# EAGLE design controller (EAGLE 9.6.2)
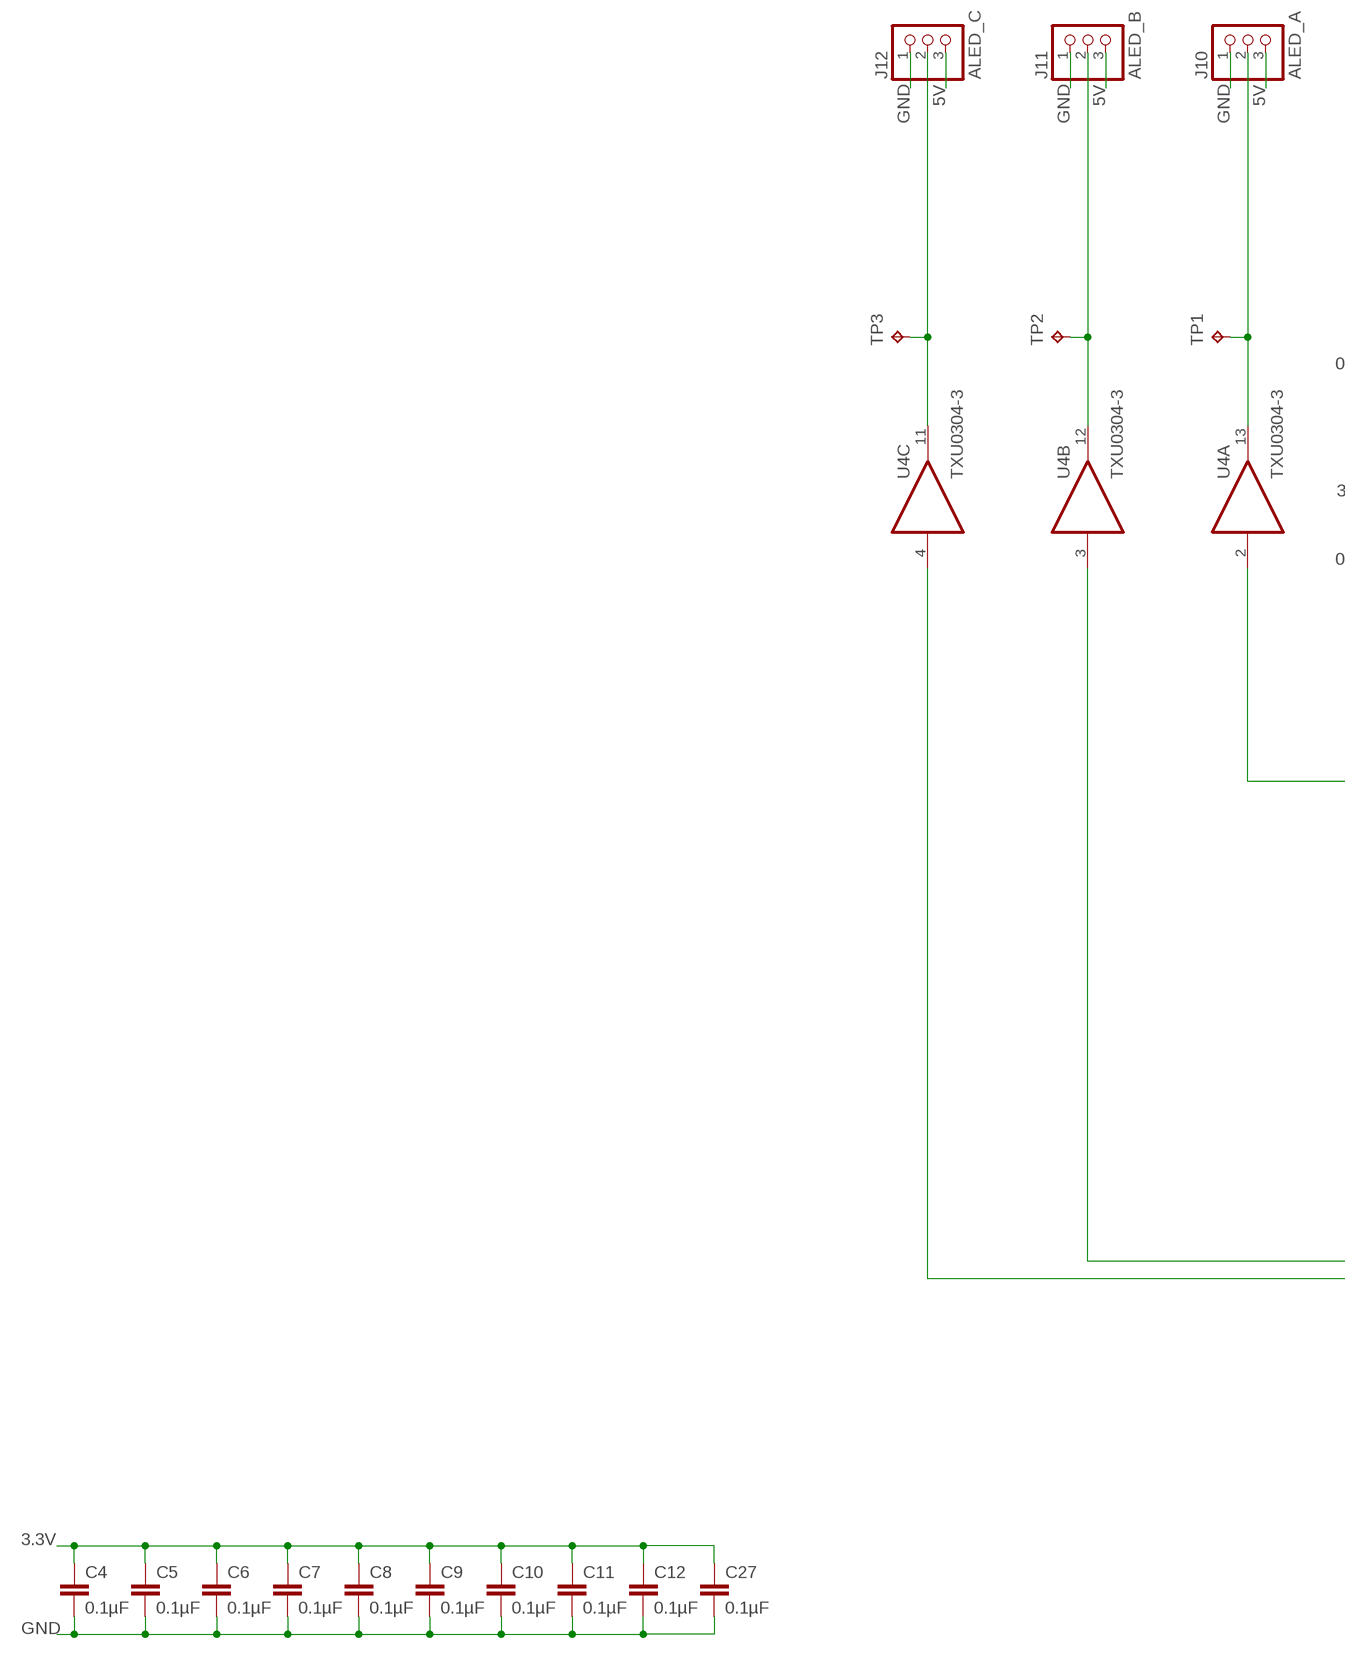
[diagram p0: schematic, sheet 1, part 1 of 3]
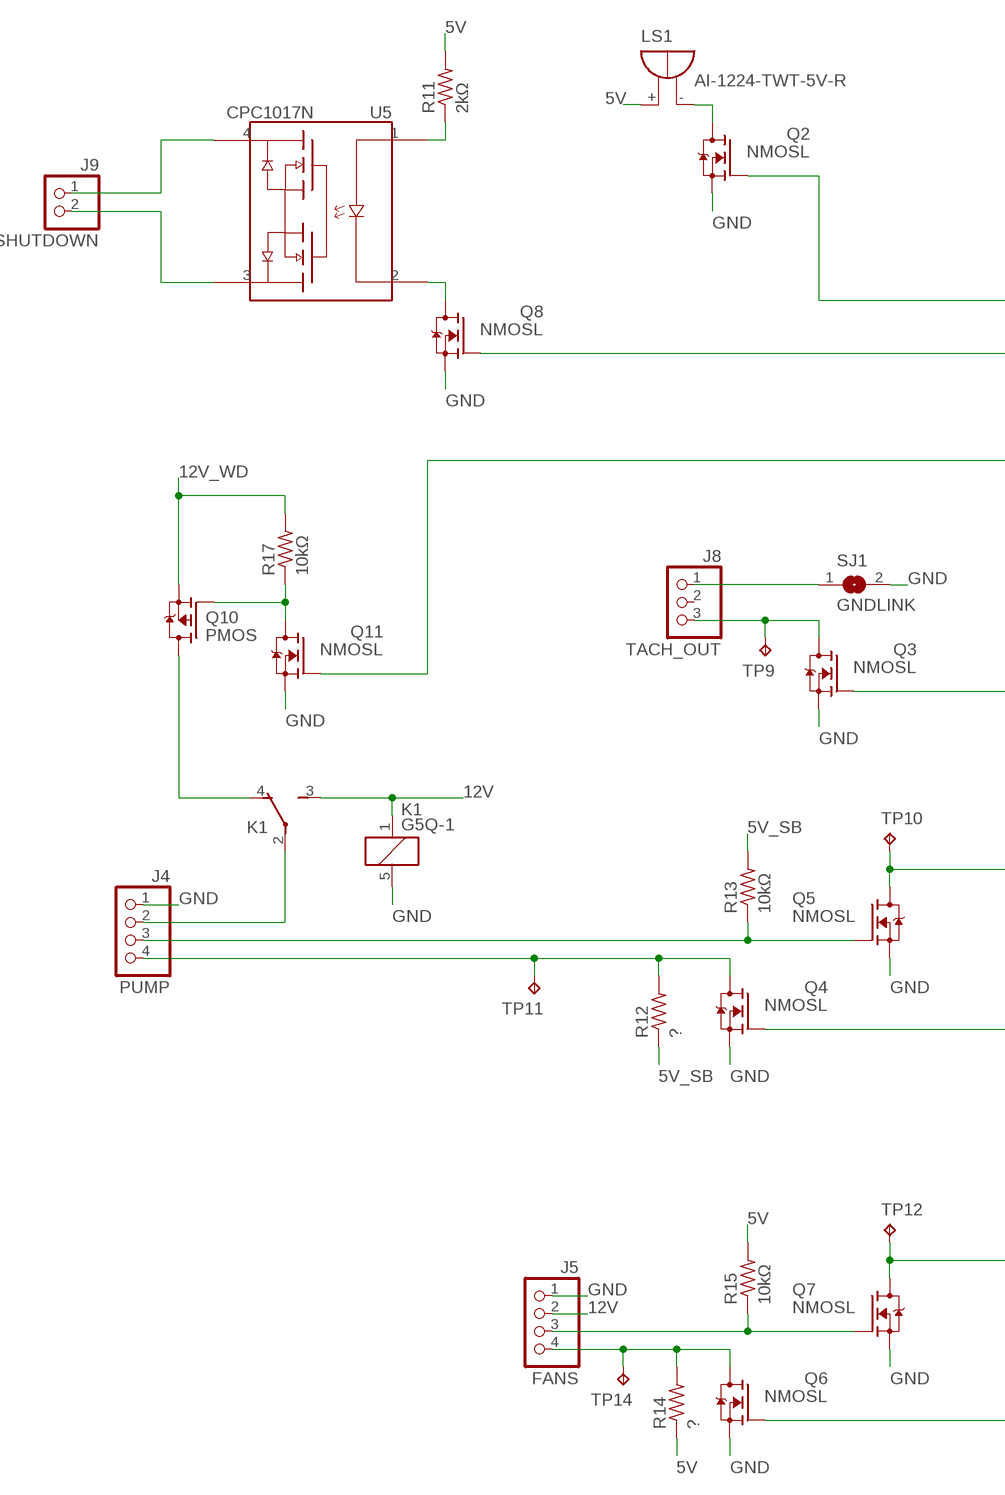
[diagram p1: schematic, sheet 1, part 2 of 3]
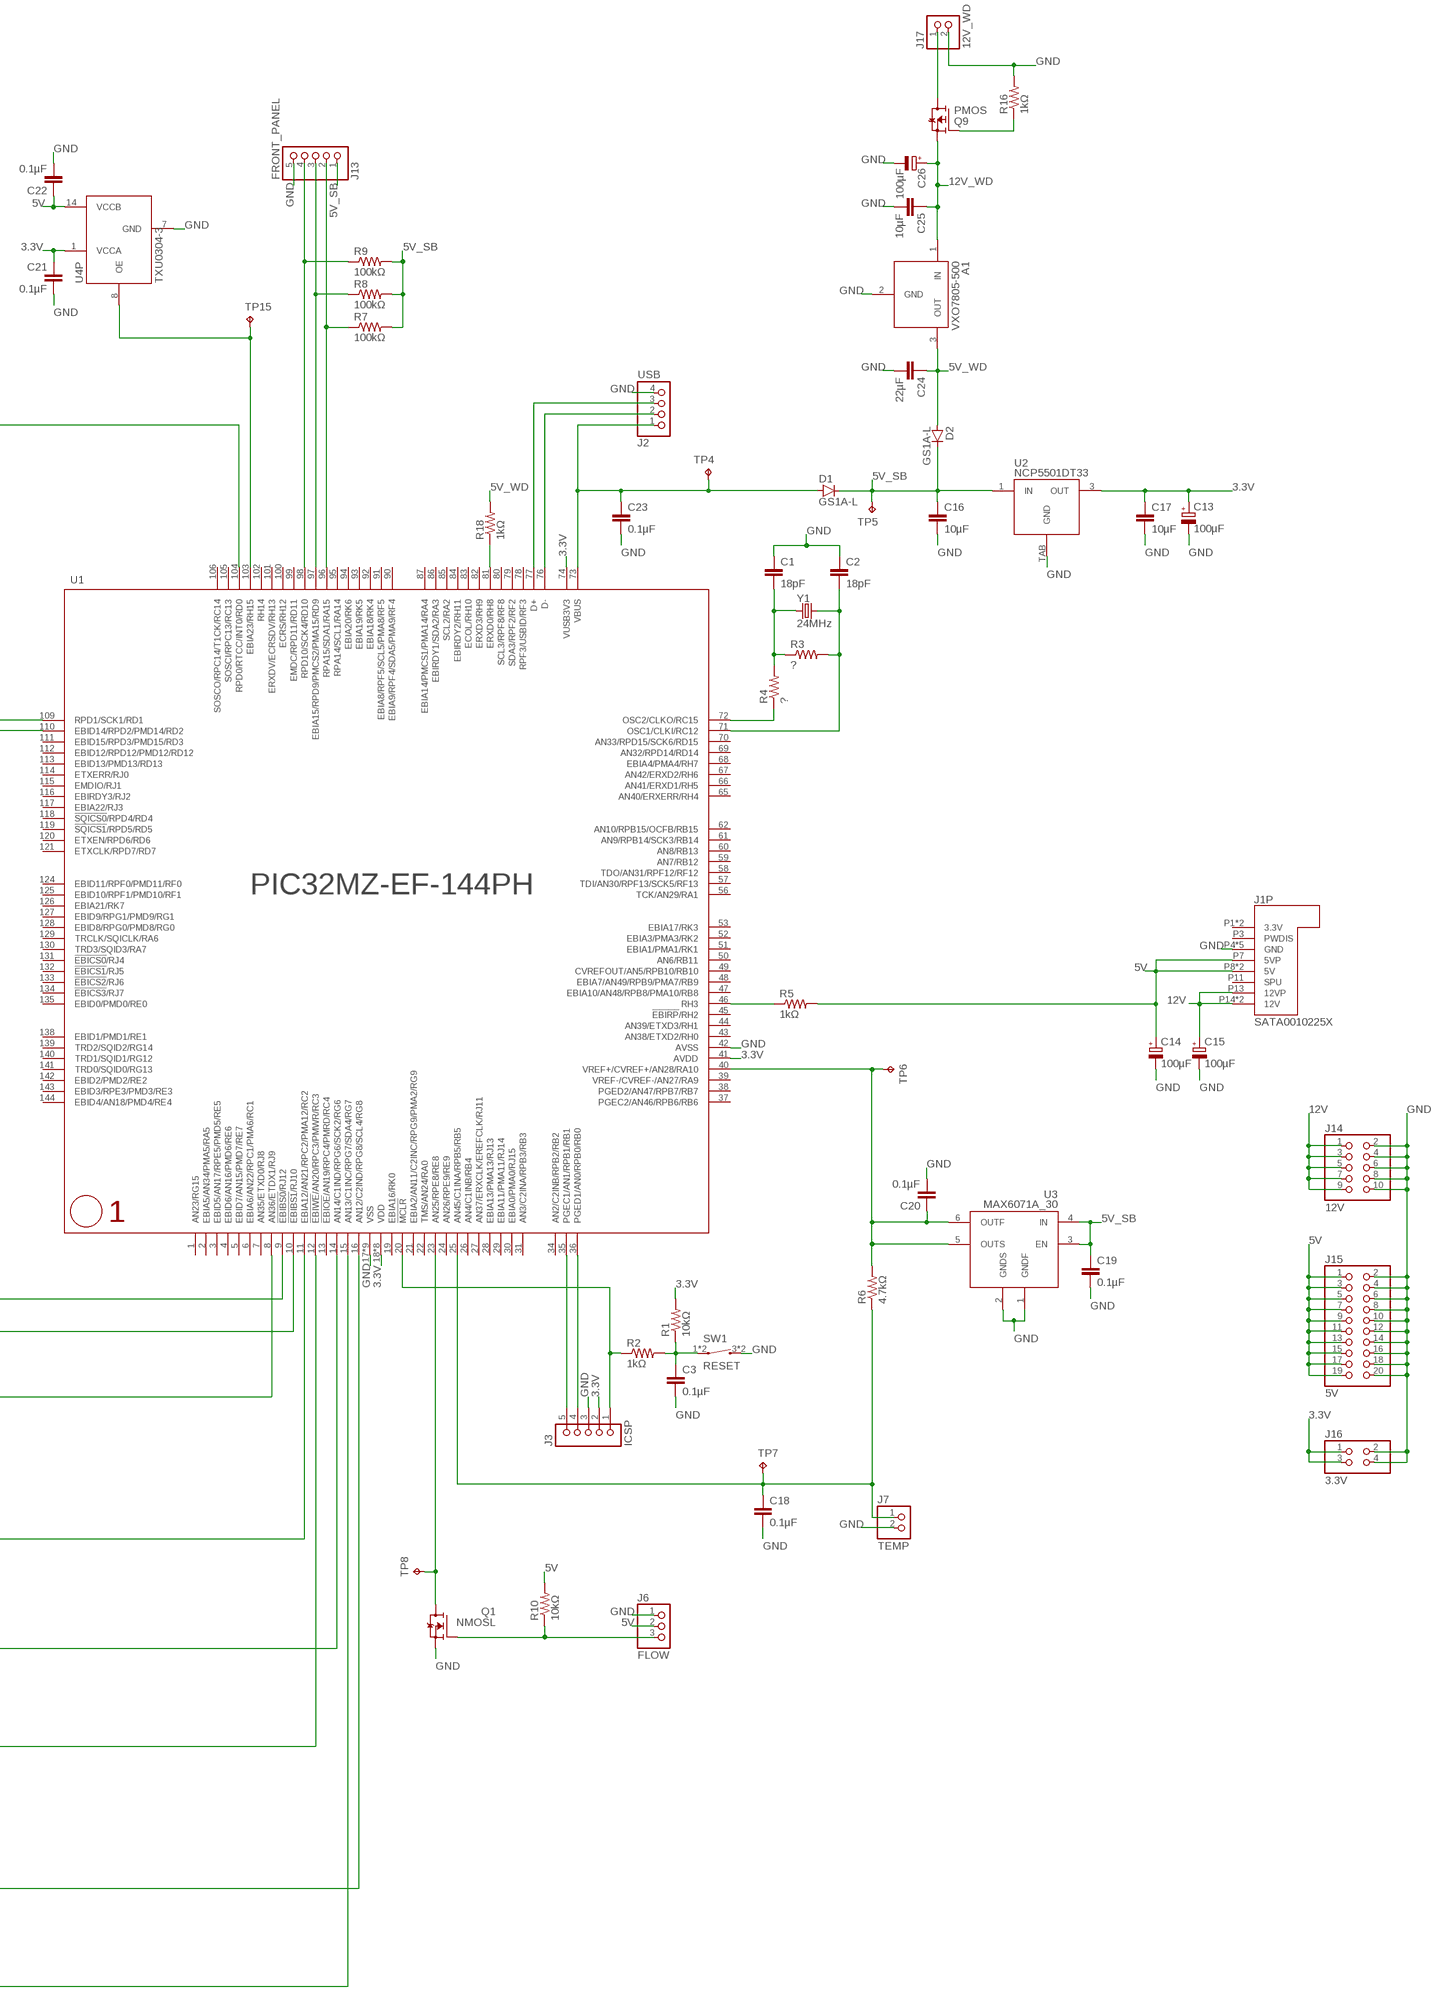
[diagram p2: schematic, sheet 1, part 3 of 3]

## Parts
A1  VXO7805-500  VXO78-500  [VXO78-500]
C1  18pF  C-EUC0603  [C0603]
C2  18pF  C-EUC0603  [C0603]
C3  0.1µF  C-EUC0603  [C0603]
C4  0.1µF  C-EUC0603  [C0603]
C5  0.1µF  C-EUC0603  [C0603]
C6  0.1µF  C-EUC0603  [C0603]
C7  0.1µF  C-EUC0603  [C0603]
C8  0.1µF  C-EUC0603  [C0603]
C9  0.1µF  C-EUC0603  [C0603]
C10  0.1µF  C-EUC0603  [C0603]
C11  0.1µF  C-EUC0603  [C0603]
C12  0.1µF  C-EUC0603  [C0603]
C13  100µF  CPOL-EUD  [PANASONIC_D]
C14  100µF  CPOL-EUD  [PANASONIC_D]
C15  100µF  CPOL-EUD  [PANASONIC_D]
C16  10µF  C-EUC0805  [C0805]
C17  10µF  C-EUC0805  [C0805]
C18  0.1µF  C-EUC0603  [C0603]
C19  0.1µF  C-EUC0603  [C0603]
C20  0.1µF  C-EUC0603  [C0603]
C21  0.1µF  C-EUC0603  [C0603]
C22  0.1µF  C-EUC0603  [C0603]
C23  0.1µF  C-EUC0603  [C0603]
C24  22µF  C-EUC0603  [C0603]
C25  10µF  C-EUC0805  [C0805]
C26  100µF  CPOL-EUD  [PANASONIC_D]
C27  0.1µF  C-EUC0603  [C0603]
D1  GS1A-L  DO-214AC-DIODE  [DO-214AC]
D2  GS1A-L  DO-214AC-DIODE  [DO-214AC]
J1  SATA0010225X  [SATA0010225X]
J2  USB  PINHD-1X4  [1X04]
J3  ICSP  5PIN-1.27  [5PIN-1.27]
J4  PUMP  47053-1000  [47053-1000]
J5  FANS  47053-1000  [47053-1000]
J6  FLOW  22-23-2032  [22-23-2032]
J7  TEMP  PINHD-1X2  [1X02]
J8  TACH_OUT  22-23-2032  [22-23-2032]
J9  SHUTDOWN  PINHD-1X2  [1X02]
J10  ALED_A  B3B-XH-A  [B3B-XH-A]
J11  ALED_B  B3B-XH-A  [B3B-XH-A]
J12  ALED_C  B3B-XH-A  [B3B-XH-A]
J13  FRONT_PANEL  PINHD-1X5  [1X05]
J14  12V  PINHD-2X5  [2X05]
J15  5V  PINHD-2X10  [2X10]
J16  3.3V  PINHD-2X2  [2X02]
J17  12V_WD  PINHD-1X2  [1X02]
K1  G5Q-1  [G5Q-1]
LS1  AI-1224-TWT-5V-R  [AI-1224-TWT-5V-R]
Q1  NMOSL  SOT23-N-MOSFET  [SOT23]
Q2  NMOSL  SOT23-N-MOSFET  [SOT23]
Q3  NMOSL  SOT23-N-MOSFET  [SOT23]
Q4  NMOSL  SOT23-N-MOSFET  [SOT23]
Q5  NMOSL  SOT23-N-MOSFET  [SOT23]
Q6  NMOSL  SOT23-N-MOSFET  [SOT23]
Q7  NMOSL  SOT23-N-MOSFET  [SOT23]
Q8  NMOSL  SOT23-N-MOSFET  [SOT23]
Q9  PMOS  SOT23-P-MOSFET  [SOT23]
Q10  PMOS  SOT23-P-MOSFET  [SOT23]
Q11  NMOSL  SOT23-N-MOSFET  [SOT23]
R1  10kΩ  R-US_R0603  [R0603]
R2  1kΩ  R-US_R0603  [R0603]
R3  ?  R-US_R0603  [R0603]
R4  ?  R-US_R0603  [R0603]
R5  1kΩ  R-US_R0603  [R0603]
R6  4.7kΩ  R-US_R0603  [R0603]
R7  100kΩ  R-US_R0603  [R0603]
R8  100kΩ  R-US_R0603  [R0603]
R9  100kΩ  R-US_R0603  [R0603]
R10  10kΩ  R-US_R0603  [R0603]
R11  2kΩ  R-US_R0603  [R0603]
R12  ?  R-US_R0603  [R0603]
R13  10kΩ  R-US_R0603  [R0603]
R14  ?  R-US_R0603  [R0603]
R15  10kΩ  R-US_R0603  [R0603]
R16  1kΩ  R-US_R0603  [R0603]
R17  10kΩ  R-US_R0603  [R0603]
R18  1kΩ  R-US_R0603  [R0603]
SJ1  GNDLINK  SJ  [SJ]
SW1  RESET  TL3305  [TL3305_MICROSWITCH]
TP1  RCU-0(J)  [TP_0603_JOINED]
TP2  RCU-0(J)  [TP_0603_JOINED]
TP3  RCU-0(J)  [TP_0603_JOINED]
TP4  RCU-0(J)  [TP_0603_JOINED]
TP5  RCU-0(J)  [TP_0603_JOINED]
TP6  RCU-0(J)  [TP_0603_JOINED]
TP7  RCU-0(J)  [TP_0603_JOINED]
TP8  RCU-0(J)  [TP_0603_JOINED]
TP9  RCU-0(J)  [TP_0603_JOINED]
TP10  RCU-0(J)  [TP_0603_JOINED]
TP11  RCU-0(J)  [TP_0603_JOINED]
TP12  RCU-0(J)  [TP_0603_JOINED]
TP14  RCU-0(J)  [TP_0603_JOINED]
TP15  RCU-0(J)  [TP_0603_JOINED]
U1  PIC32MZ-EF-144PH  [TQFP144-16X16]
U2  NCP5501DT33  DPAK-LDO  [DPAK]
U3  MAX6071A_30  [SOT23-6L]
U4  TXU0304-3  [TSSOP14]
U5  CPC1017N  [CPC10*N]
Y1  24MHz  HC49/4HSMX-CRYSTAL  [HC49/4HSMX]

## Nets
3.3V: C4.1 C5.1 C6.1 C7.1 C8.1 C9.1 C10.1 C11.1 C12.1 C13.+ C17.1 C21.1 C27.1 J3.2 J16.1 J16.3 R1.2 U1.18(VDD) U1.33(VDD) U1.41(AVDD) U1.55(VDD) U1.64(VDD) U1.74(VUSB3V3) U1.88(VDD) U1.107(VDD) U1.122(VDD) U1.137(VDD) U2.3(OUT) U4.1(P:VCCA)
3V_REF: C20.1 R6.2 TP6.1(TP) U1.40(VREF+/CVREF+/AN28/RA10) U3.5(OUTS) U3.6(OUTF)
5V: C14.+ C22.1 J1.P7(P:5VP) J1.P8(P:5V) J1.P9(P:5V) J6.2 J10.3 J11.3 J12.3 J15.1 J15.3 J15.5 J15.7 J15.9 J15.11 J15.13 J15.15 J15.17 J15.19 LS1.+ R5.2 R10.2 R11.2 R14.1 R15.2 U4.14(P:VCCB)
5V_SB: C16.1 C19.1 D1.C D2.C J13.1 R7.2 R8.2 R9.2 R12.1 R13.2 TP5.1(TP) U2.1(IN) U3.3(EN) U3.4(IN)
5V_USB: C23.1 D1.A J2.1 TP4.1(TP) U1.73(VBUS)
5V_WD: A1.3(OUT) C24.1 D2.A R18.2
12V: C15.+ J1.P13(P:12VP) J1.P14(P:12V) J1.P15(P:12V) J5.2 J14.1 J14.3 J14.5 J14.7 J14.9 K1.1 K1.3(S)
12V_PUMP: J4.2 K1.2(P)
12V_PUMP_WD: K1.4(O) Q10.3(D)
12V_WD: A1.1(IN) C25.1 C26.+ Q9.2(S) Q10.2(S) R17.2
12V_WD_PROTECT: Q9.1(G) R16.1
12V_WD_RAW: J17.1 Q9.3(D)
!MCLR: J3.1 R2.1 U1.20(!MCLR)
!MCLR!_FILTER: C3.1 R1.1 R2.2 SW1.1 SW1.2
ALED_A: J10.2 TP1.1(TP) U4.13(A:O)
ALED_A_RAW: U1.104(RPD0/RTCC/INT0/RD0) U4.2(A:I)
ALED_B: J11.2 TP2.1(TP) U4.12(B:O)
ALED_B_RAW: U1.109(RPD1/SCK1/RD1) U4.3(B:I)
ALED_C: J12.2 TP3.1(TP) U4.11(C:O)
ALED_C_RAW: U1.110(EBID14/RPD2/PMD14/RD2) U4.4(C:I)
ALED_OE: TP15.1(TP) U1.103(EBIA23/RH15) U4.8(P:OE)
BUZZER_EN: Q2.1(G) U1.9(!EBIBS0!/RJ12)
BUZZER_L: LS1.- Q2.3(D)
EMERGENCY_SD_C1: J9.1 U5.4
EMERGENCY_SD_C2: J9.2 U5.3
EMERGENCY_SD_DRIVE+: R11.1 U5.1(A)
EMERGENCY_SD_DRIVE-: Q8.3(D) U5.2(K)
EMERGENCY_SD_TRIGGER: Q8.1(G) U1.10(!EBIBS1!/RJ10)
FAN_PWM: J5.4 Q6.3(D) R14.2 TP14.1(TP)
FAN_PWM_DRIVE: Q6.1(G) U1.15(AN13/C1INC/RPG7/SDA4/RG7)
FAN_TACH: Q7.3(D) TP12.1(TP) U1.16(AN12/C2IND/RPG8/SCL4/RG8)
FAN_TACH_RAW: J5.3 Q7.1(G) R15.1
FLOW_TACH: Q1.3(D) TP8.1(TP) U1.23(AN25/RPE8/RE8)
FLOW_TACH_RAW: J6.3 Q1.1(G) R10.1
FPLED_!B: J13.4 R9.1 U1.98(RPD10/SCK4/RD10)
FPLED_!G: J13.3 R8.1 U1.97(EBIA15/RPD9/PMCS2/PMA15/RD9)
FPLED_!R: J13.2 R7.1 U1.96(RPA15/SDA1/RA15)
GND: A1.2(GND) C1.1 C2.1 C3.2 C4.2 C5.2 C6.2 C7.2 C8.2 C9.2 C10.2 C11.2 C12.2 C13.- C14.- C15.- C16.2 C17.2 C18.2 C19.2 C20.2 C21.2 C22.2 C23.2 C24.2 C25.2 C26.- C27.2 J1.P4(P:GND) J1.P5(P:GND) J1.P6(P:GND) J1.P10(P:GND) J1.P12(P:GND) J2.4 J3.3 J4.1 J5.1 J6.1 J7.2 J10.1 J11.1 J12.1 J13.5 J14.2 J14.4 J14.6 J14.8 J14.10 J15.2 J15.4 J15.6 J15.8 J15.10 J15.12 J15.14 J15.16 J15.18 J15.20 J16.2 J16.4 J17.2 K1.5 Q1.2(S) Q2.2(S) Q3.2(S) Q4.2(S) Q5.2(S) Q6.2(S) Q7.2(S) Q8.2(S) Q11.2(S) R16.2 SJ1.2 SW1.3 SW1.4 U1.17(VSS) U1.32(VSS) U1.42(AVSS) U1.54(VSS) U1.63(VSS) U1.75(VSS) U1.89(VSS) U1.108(VSS) U1.123(VSS) U1.136(VSS) U2.TAB(GND) U3.1(GNDF) U3.2(GNDS) U4.7(P:GND)
OSC1: C2.2 R3.2 U1.71(OSC1/CLKI/RC12) Y1.2
OSC2: R4.1 U1.72(OSC2/CLKO/RC15)
OSC2_R: C1.2 R3.1 R4.2 Y1.1
PGEC: J3.5 U1.35(PGEC1/AN1/RPB1/RB1)
PGED: J3.4 U1.36(PGED1/AN0/RPB0/RB0)
POWER_SENSE: R5.1 U1.46(RH3)
PUMP_PWM: J4.4 Q4.3(D) R12.2 TP11.1(TP)
PUMP_PWM_DRIVE: Q4.1(G) U1.12(!EBIWE!/AN20/RPC3/PMWR/RC3)
PUMP_TACH: Q5.3(D) TP10.1(TP) U1.14(AN14/C1IND/RPG6/SCK2/RG6)
PUMP_TACH_RAW: J4.3 Q5.1(G) R13.1
PUMP_WD_DRIVE: Q10.1(G) Q11.3(D) R17.1
PUMP_WD_RUN: Q11.1(G) U1.8(AN36/ETDX1/RJ9)
TACH_OUT: J8.3 Q3.3(D) TP9.1(TP)
TACH_OUT_DRIVE: Q3.1(G) U1.11(EBIA12/AN21/RPC2/PMA12/RC2)
TACH_OUT_GNDLINK: J8.1 SJ1.1
TEMP_SENSE: C18.1 J7.1 R6.1 TP7.1(TP) U1.25(AN45/C1INA/RPB5/RB5)
USB_D+: J2.3 U1.77(D+)
USB_D-: J2.2 U1.76(D-)
WD_DETECT: R18.1 U1.81(ERXD0/RH8)
Unconnected: J1.D1(D:GND) J1.D2(D:A+) J1.D3(D:A-) J1.D4(D:GND) J1.D5(D:B-) J1.D6(D:B+) J1.D7(D:GND) J1.P1(P:3.3V) J1.P2(P:3.3V) J1.P3(P:PWDIS) J1.P11(P:SPU) J8.2 U1.1(AN23/RG15) U1.2(EBIA5/AN34/PMA5/RA5) U1.3(EBID5/AN17/RPE5/PMD5/RE5) U1.4(EBID6/AN16/PMD6/RE6) U1.5(EBID7/AN15/PMD7/RE7) U1.6(EBIA6/AN22/RPC1/PMA6/RC1) U1.7(AN35/ETXD0/RJ8) U1.13(!EBIOE!/AN19/RPC4/PMRD/RC4) U1.19(EBIA16/RK0) U1.21(EBIA2/AN11/C2INC/RPG9/PMA2/RG9) U1.22(TMS/AN24/RA0) U1.24(AN26/RPE9/RE9) U1.26(AN4/C1INB/RB4) U1.27(AN37/ERXCLK/EREFCLK/RJ11) U1.28(EBIA13/PMA13/RJ13) U1.29(EBIA11/PMA11/RJ14) U1.30(EBIA0/PMA0/RJ15) U1.31(AN3/C2INA/RPB3/RB3) U1.34(AN2/C2INB/RPB2/RB2) U1.37(PGEC2/AN46/RPB6/RB6) U1.38(PGED2/AN47/RPB7/RB7) U1.39(VREF-/CVREF-/AN27/RA9) U1.43(AN38/ETXD2/RH0) U1.44(AN39/ETXD3/RH1) U1.45(!EBIRP!/RH2) U1.47(EBIA10/AN48/RPB8/PMA10/RB8) U1.48(EBIA7/AN49/RPB9/PMA7/RB9) U1.49(CVREFOUT/AN5/RPB10/RB10) U1.50(AN6/RB11) U1.51(EBIA1/PMA1/RK1) U1.52(EBIA3/PMA3/RK2) U1.53(EBIA17/RK3) U1.56(TCK/AN29/RA1) U1.57(TDI/AN30/RPF13/SCK5/RF13) U1.58(TDO/AN31/RPF12/RF12) U1.59(AN7/RB12) U1.60(AN8/RB13) U1.61(AN9/RPB14/SCK3/RB14) U1.62(AN10/RPB15/OCFB/RB15) U1.65(AN40/ERXERR/RH4) U1.66(AN41/ERXD1/RH5) U1.67(AN42/ERXD2/RH6) U1.68(EBIA4/PMA4/RH7) U1.69(AN32/RPD14/RD14) U1.70(AN33/RPD15/SCK6/RD15) U1.78(RPF3/USBID/RF3) U1.79(SDA3/RPF2/RF2) U1.80(SCL3/RPF8/RF8) U1.82(ERXD3/RH9) U1.83(ECOL/RH10) U1.84(EBIRDY2/RH11) U1.85(SCL2/RA2) U1.86(EBIRDY1/SDA2/RA3) U1.87(EBIA14/PMCS1/PMA14/RA4) U1.90(EBIA9/RPF4/SDA5/PMA9/RF4) U1.91(EBIA8/RPF5/SCL5/PMA8/RF5) U1.92(EBIA18/RK4) U1.93(EBIA19/RK5) U1.94(EBIA20/RK6) U1.95(RPA14/SCL1/RA14) U1.99(EMDC/RPD11/RD11) U1.100(ECRS/RH12) U1.101(ERXDV/ECRSDV/RH13) U1.102(RH14) U1.105(SOSCI/RPC13/RC13) U1.106(SOSCO/RPC14/T1CK/RC14) U1.111(EBID15/RPD3/PMD15/RD3) U1.112(EBID12/RPD12/PMD12/RD12) U1.113(EBID13/PMD13/RD13) U1.114(ETXERR/RJ0) U1.115(EMDIO/RJ1) U1.116(EBIRDY3/RJ2) U1.117(EBIA22/RJ3) U1.118(!SQICS0!/RPD4/RD4) U1.119(!SQICS1!/RPD5/RD5) U1.120(ETXEN/RPD6/RD6) U1.121(ETXCLK/RPD7/RD7) U1.124(EBID11/RPF0/PMD11/RF0) U1.125(EBID10/RPF1/PMD10/RF1) U1.126(EBIA21/RK7) U1.127(EBID9/RPG1/PMD9/RG1) U1.128(EBID8/RPG0/PMD8/RG0) U1.129(TRCLK/SQICLK/RA6) U1.130(TRD3/SQID3/RA7) U1.131(!EBICS0!/RJ4) U1.132(!EBICS1!/RJ5) U1.133(!EBICS2!/RJ6) U1.134(!EBICS3!/RJ7) U1.135(EBID0/PMD0/RE0) U1.138(EBID1/PMD1/RE1) U1.139(TRD2/SQID2/RG14) U1.140(TRD1/SQID1/RG12) U1.141(TRD0/SQID0/RG13) U1.142(EBID2/PMD2/RE2) U1.143(EBID3/RPE3/PMD3/RE3) U1.144(EBID4/AN18/PMD4/RE4) U4.5(D:O) U4.10(D:I)

## Library data of the parts
A1 = BW-Active:VXO78-500: Low power switching voltage regulator module, 500mA output
C1-C12 C16-C25 C27 = rcl:C-EU: CAPACITOR, European symbol; SPICEPREFIX: C
C13-C15 C26 = rcl:CPOL-EU: POLARIZED CAPACITOR, European symbol; SPICEPREFIX: C
D1 D2 = BW-Active:DO-214AC-DIODE
J1 = BW-Connectors:SATA0010225X: SATA 15+7 pin male connector
J2 = pinhead:PINHD-1X4: PIN HEADER
J3 = BW-Connectors:5PIN-1.27: 5 pin header with 1.27mm pitch
J4 J5 = BW-Connectors:47053-1000: 4-pin Molex KK connector (PC fan, 3+1)
J6 J8 = BW-Connectors:22-23-2032: 3-pin Molex KK connector (PC fan)
J7 J9 J17 = pinhead:PINHD-1X2: PIN HEADER
J10-J12 = BW-Connectors:*3B-XH-A: JST XH 3-pin locking header
J13 = pinhead:PINHD-1X5: PIN HEADER
J14 = pinhead:PINHD-2X5: PIN HEADER
J15 = pinhead:PINHD-2X10: PIN HEADER
J16 = pinhead:PINHD-2X2: PIN HEADER
K1 = BW-PassiveMechanical:G5Q-1: Form C (DPDT) PCB relay
LS1 = BW-Active:AI-1224-TWT-5V-R: 5V DC buzzer
Q1-Q8 Q11 = BW-Active:SOT23-N-MOSFET
Q9 Q10 = BW-Active:SOT23-P-MOSFET
R1-R18 = resistor:R-US_: RESISTOR, American symbol
SJ1 = jumper:SJ: SMD solder JUMPER
SW1 = BW-PassiveMechanical:TL3305: Tactile microswitch
TP1-TP12 TP14 TP15 = BW-PassiveMechanical:RCU-0: Solderable probe pad in 0603 form
U1 = BW-Active:PIC32MZ-EF-144: 32-bit 200MHz microcontroller, 144-pin
U2 = BW-Active:DPAK-LDO
U3 = BW-Active:MAX6071*: Precision voltage reference
U4 = BW-Active:TXU0*04: 4-pin unidirectional level shifter
U5 = BW-Active:CPC1017N: 100mA solid state relay
Y1 = BW-PassiveMechanical:HC49/4HSMX-CRYSTAL

## Board
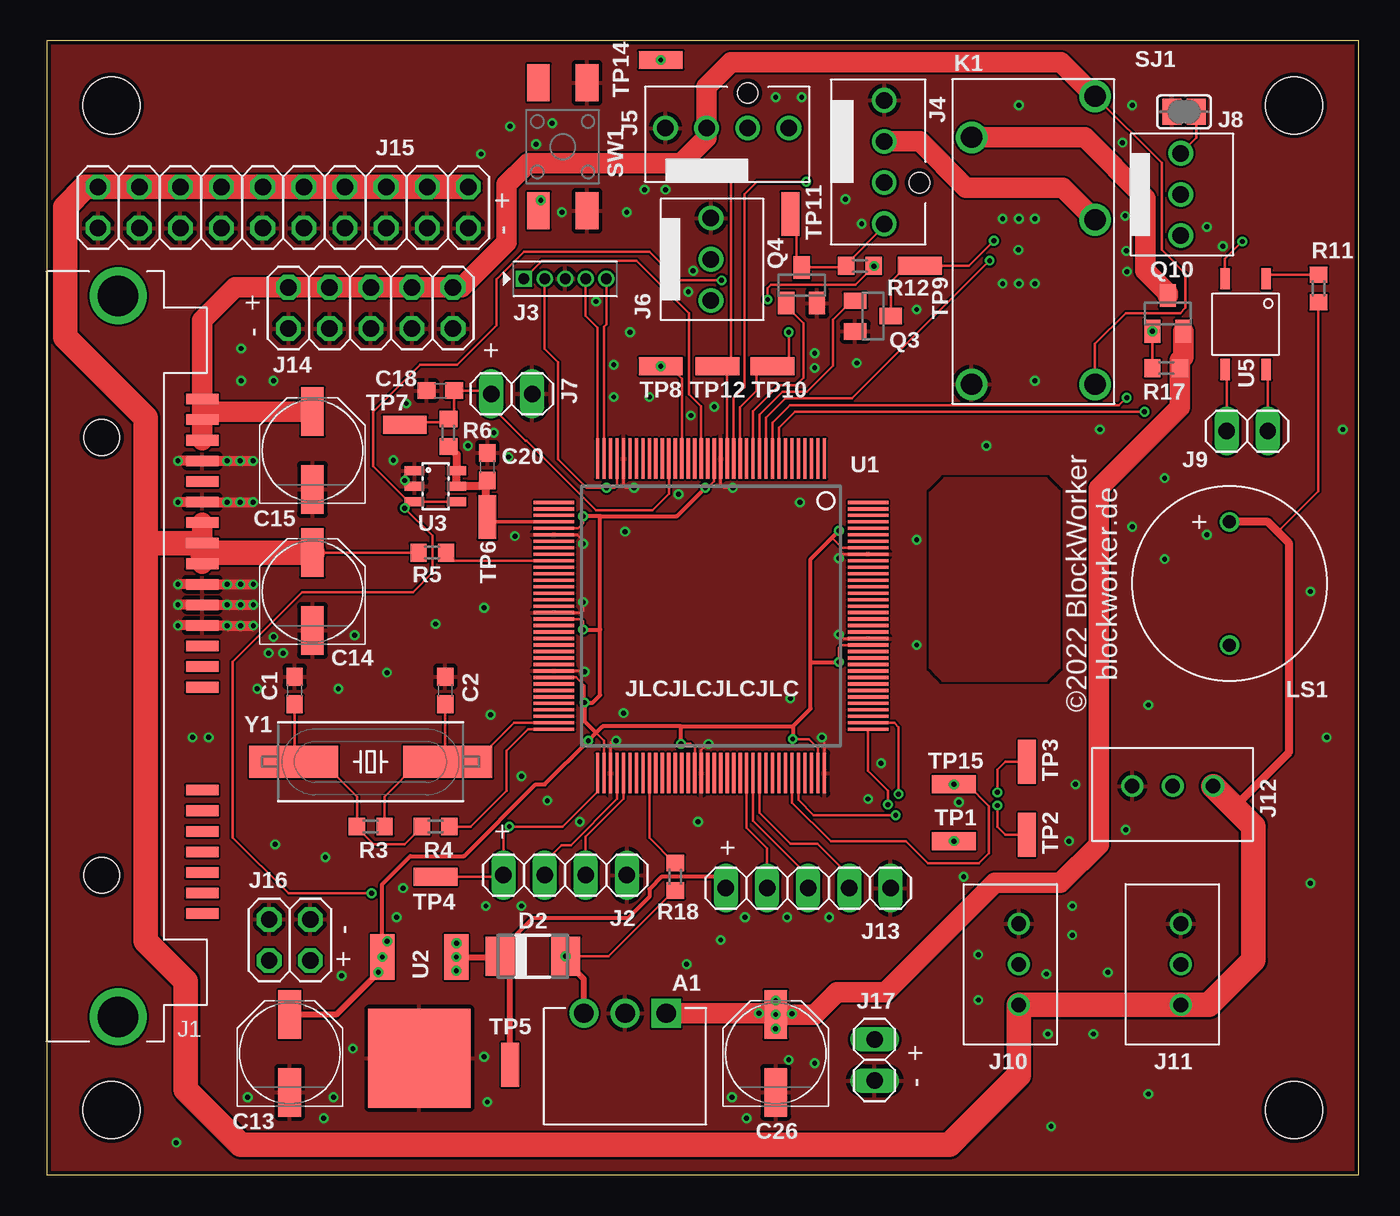
[diagram p3: board, top side]
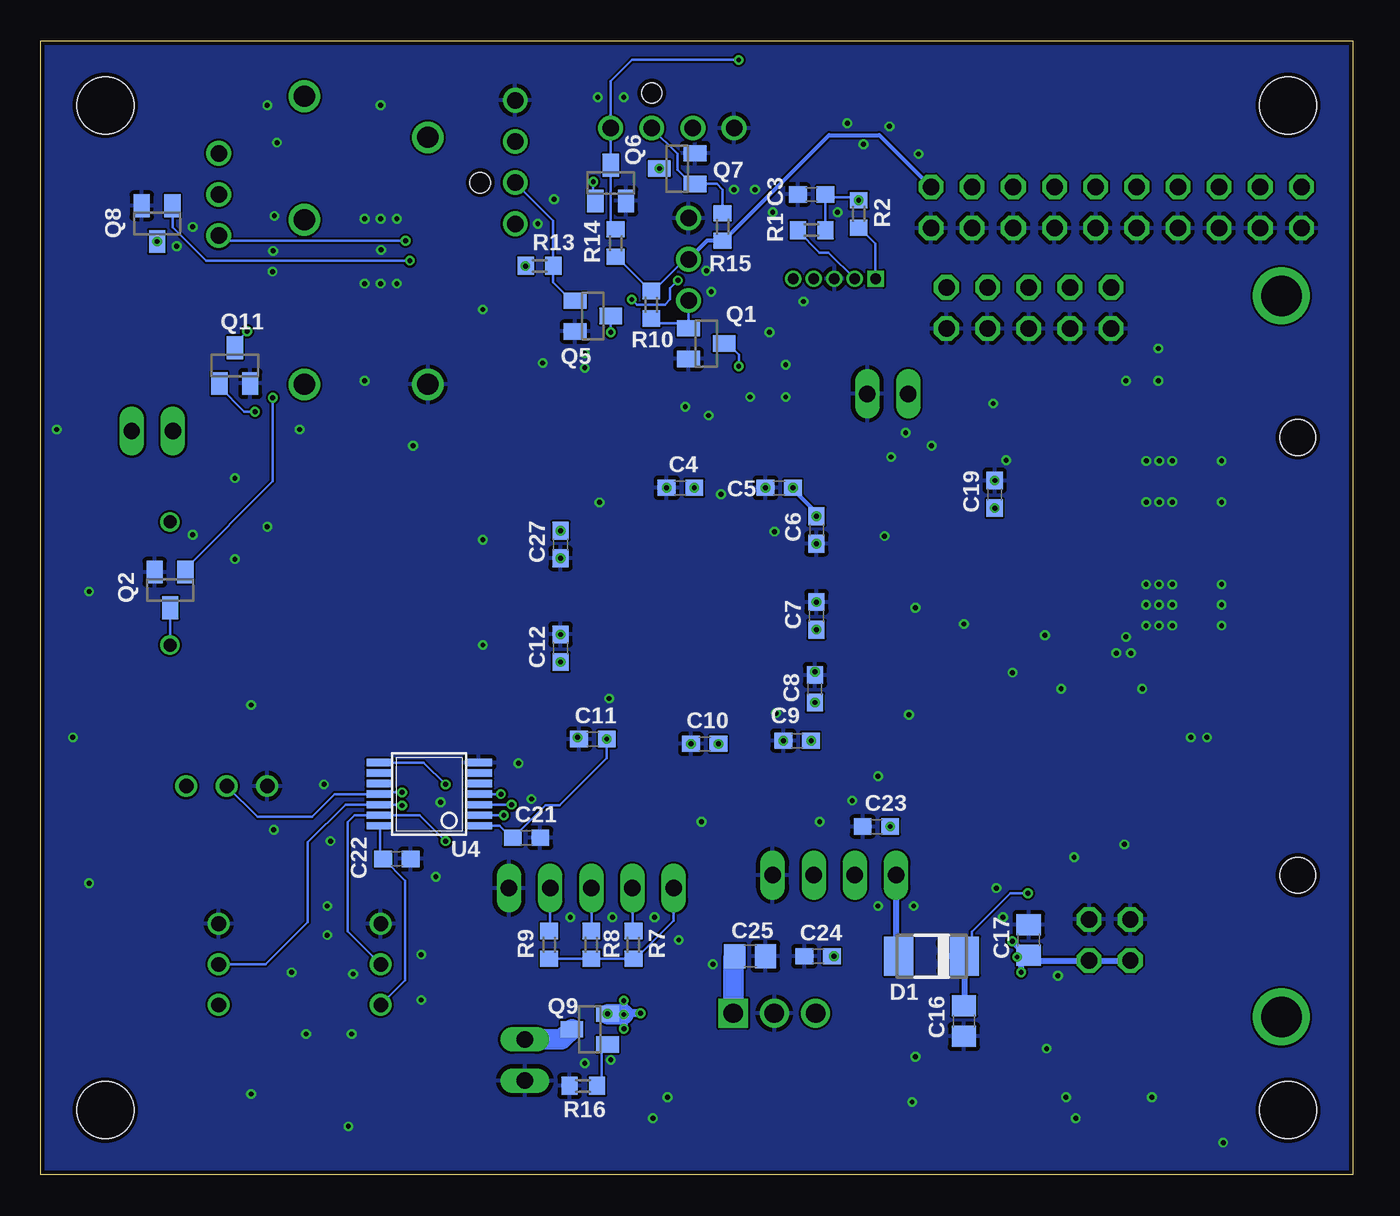
[diagram p4: board, bottom side, seen from below]

Size 81 x 70 mm. Coordinates in mm from the lower left corner, seen from the top.
Outline: 0,0 81,0 81,70 0,70 0,0
Copper layers (1*16): Top 0.035mm / dielectric 1.6mm / Bottom 0.035mm
Design rules "jlcpcb-2l": minimum track width 5mil, minimum drill 0.3mm, track to track 5mil, track to pad 5mil, pad to pad 5mil, via to via 5mil, smd to smd 0mil, copper to edge 0.25mm, drill to drill 0.5mm, minimum pad ring 0.15mm, minimum via ring 0.15mm, stop-mask expansion 4mil, vias tented up to drill 0.3mm, thermal gap 10mil
Holes 3.5 mm at 4,4 4,66 77,4 77,66
tKeepout: area 1,1 to 7,7; area 1,63 to 7,69; area 74,1 to 80,7; area 74,63 to 80,69

### Footprints (pad centres in the part's own frame; a part is rotated, then mirrored left to right if it is on the bottom)
VXO78-500 = drill 1.2 square: 1 -2.54,-3.28 | drill 1.2: 2 0,-3.28; 3 2.54,-3.28
C0603 = smd 1.1 x 1: 1 -0.85,0; 2 0.85,0
PANASONIC_D = smd 3 x 1.4: + 2.4,0; - -2.4,0
C0805 = smd 1.3 x 1.5: 1 -0.95,0; 2 0.95,0
DO-214AC = smd 1.8 x 2.4: A 2.025,0; C -2.025,0
SATA0010225X = smd 0.65 x 2: D1 15.875,9.6; D2 14.605,9.6; D3 13.335,9.6; D4 12.065,9.6; D5 10.795,9.6; D6 9.525,9.6; D7 8.255,9.6; P1 1.905,9.6; P2 0.635,9.6; P3 -0.635,9.6; P4 -1.905,9.6; P5 -3.175,9.6; P6 -4.445,9.6; P7 -5.715,9.6; P8 -6.985,9.6; P9 -8.255,9.6; P10 -9.525,9.6; P11 -10.795,9.6; P12 -12.065,9.6; P13 -13.335,9.6; P14 -14.605,9.6; P15 -15.875,9.6 | drill 2.5: H1 -22.25,4.4; H2 22.25,4.4 | hole 2.2: -13.5,3.4; 13.5,3.4
1X04 = drill 1.016 long: 1 -3.81,0; 2 -1.27,0; 3 1.27,0; 4 3.81,0
5PIN-1.27 = drill 0.65 pad 1.016 square: 1 -2.54,0 | drill 0.65 pad 1.016: 2 -1.27,0; 3 0,0; 4 1.27,0; 5 2.54,0
47053-1000 = drill 1.016: 1 3.81,0; 2 1.27,0; 3 -1.27,0; 4 -3.81,0 | hole 1.25: -1.27,-2.16
22-23-2032 = drill 1.016: 1 2.54,0; 2 0,0; 3 -2.54,0
1X02 = drill 1.016 long: 1 -1.27,0; 2 1.27,0
B3B-XH-A = drill 0.9: 1 -2.5,0; 2 0,0; 3 2.5,0
1X05 = drill 1.016 long: 1 -5.08,0; 2 -2.54,0; 3 0,0; 4 2.54,0; 5 5.08,0
2X05 = drill 1.016 octagon: 1 -5.08,-1.27; 2 -5.08,1.27; 3 -2.54,-1.27; 4 -2.54,1.27; 5 0,-1.27; 6 0,1.27; 7 2.54,-1.27; 8 2.54,1.27; 9 5.08,-1.27; 10 5.08,1.27
2X10 = drill 1.016 octagon: 1 -11.43,-1.27; 2 -11.43,1.27; 3 -8.89,-1.27; 4 -8.89,1.27; 5 -6.35,-1.27; 6 -6.35,1.27; 7 -3.81,-1.27; 8 -3.81,1.27; 9 -1.27,-1.27; 10 -1.27,1.27; 11 1.27,-1.27; 12 1.27,1.27; 13 3.81,-1.27; 14 3.81,1.27; 15 6.35,-1.27; 16 6.35,1.27; 17 8.89,-1.27; 18 8.89,1.27; 19 11.43,-1.27; 20 11.43,1.27
2X02 = drill 1.016 octagon: 1 -1.27,-1.27; 2 -1.27,1.27; 3 1.27,-1.27; 4 1.27,1.27
G5Q-1 = drill 1.3: 1 -8.82,-3.81; 2 1.34,-3.81; 3 8.96,-3.81; 4 6.42,3.81; 5 -8.82,3.81
AI-1224-TWT-5V-R = drill 0.8: + -3.8,0; - 3.8,0
SOT23 = smd 1 x 1.4: 1 -0.95,-1.1; 2 0.95,-1.1; 3 0,1.1
R0603 = smd 1 x 1.1: 1 -0.85,0; 2 0.85,0
SJ = smd 1.168 x 1.6: 1 -0.762,0; 2 0.762,0
TL3305_MICROSWITCH = smd 2.3 x 1.4: 1 -1.7,0.75; 2 6.2,0.75; 3 -1.7,3.75; 4 6.2,3.75
TP_0603_JOINED = smd 2.7 x 1.1: 1 0,0
TQFP144-16X16 = smd 0.2 x 2.5: 1 -7,-9.7; 2 -6.6,-9.7; 3 -6.2,-9.7; 4 -5.8,-9.7; 5 -5.4,-9.7; 6 -5,-9.7; 7 -4.6,-9.7; 8 -4.2,-9.7; 9 -3.8,-9.7; 10 -3.4,-9.7; 11 -3,-9.7; 12 -2.6,-9.7; 13 -2.2,-9.7; 14 -1.8,-9.7; 15 -1.4,-9.7; 16 -1,-9.7; 17 -0.6,-9.7; 18 -0.2,-9.7; 19 0.2,-9.7; 20 0.6,-9.7; 21 1,-9.7; 22 1.4,-9.7; 23 1.8,-9.7; 24 2.2,-9.7; 25 2.6,-9.7; 26 3,-9.7; 27 3.4,-9.7; 28 3.8,-9.7; 29 4.2,-9.7; 30 4.6,-9.7; 31 5,-9.7; 32 5.4,-9.7; 33 5.8,-9.7; 34 6.2,-9.7; 35 6.6,-9.7; 36 7,-9.7; 73 7,9.7; 74 6.6,9.7; 75 6.2,9.7; 76 5.8,9.7; 77 5.4,9.7; 78 5,9.7; 79 4.6,9.7; 80 4.2,9.7; 81 3.8,9.7; 82 3.4,9.7; 83 3,9.7; 84 2.6,9.7; 85 2.2,9.7; 86 1.8,9.7; 87 1.4,9.7; 88 1,9.7; 89 0.6,9.7; 90 0.2,9.7; 91 -0.2,9.7; 92 -0.6,9.7; 93 -1,9.7; 94 -1.4,9.7; 95 -1.8,9.7; 96 -2.2,9.7; 97 -2.6,9.7; 98 -3,9.7; 99 -3.4,9.7; 100 -3.8,9.7; 101 -4.2,9.7; 102 -4.6,9.7; 103 -5,9.7; 104 -5.4,9.7; 105 -5.8,9.7; 106 -6.2,9.7; 107 -6.6,9.7; 108 -7,9.7 | smd 2.5 x 0.2: 37 9.7,-7; 38 9.7,-6.6; 39 9.7,-6.2; 40 9.7,-5.8; 41 9.7,-5.4; 42 9.7,-5; 43 9.7,-4.6; 44 9.7,-4.2; 45 9.7,-3.8; 46 9.7,-3.4; 47 9.7,-3; 48 9.7,-2.6; 49 9.7,-2.2; 50 9.7,-1.8; 51 9.7,-1.4; 52 9.7,-1; 53 9.7,-0.6; 54 9.7,-0.2; 55 9.7,0.2; 56 9.7,0.6; 57 9.7,1; 58 9.7,1.4; 59 9.7,1.8; 60 9.7,2.2; 61 9.7,2.6; 62 9.7,3; 63 9.7,3.4; 64 9.7,3.8; 65 9.7,4.2; 66 9.7,4.6; 67 9.7,5; 68 9.7,5.4; 69 9.7,5.8; 70 9.7,6.2; 71 9.7,6.6; 72 9.7,7; 109 -9.7,7; 110 -9.7,6.6; 111 -9.7,6.2; 112 -9.7,5.8; 113 -9.7,5.4; 114 -9.7,5; 115 -9.7,4.6; 116 -9.7,4.2; 117 -9.7,3.8; 118 -9.7,3.4; 119 -9.7,3; 120 -9.7,2.6; 121 -9.7,2.2; 122 -9.7,1.8; 123 -9.7,1.4; 124 -9.7,1; 125 -9.7,0.6; 126 -9.7,0.2; 127 -9.7,-0.2; 128 -9.7,-0.6; 129 -9.7,-1; 130 -9.7,-1.4; 131 -9.7,-1.8; 132 -9.7,-2.2; 133 -9.7,-2.6; 134 -9.7,-3; 135 -9.7,-3.4; 136 -9.7,-3.8; 137 -9.7,-4.2; 138 -9.7,-4.6; 139 -9.7,-5; 140 -9.7,-5.4; 141 -9.7,-5.8; 142 -9.7,-6.2; 143 -9.7,-6.6; 144 -9.7,-7
DPAK = smd 1.5 x 2.8: 1 -2.286,-3.95; 3 2.286,-3.95 | smd 6.3 x 6.1: TAB 0,2.3
SOT23-6L = smd 0.55 x 1.2: 1 -0.95,-1.3; 2 0,-1.3; 3 0.95,-1.3; 4 0.95,1.3; 5 0,1.3; 6 -0.95,1.3
TSSOP14 = smd 0.45 x 1.65: 1 -1.95,-3.05; 2 -1.3,-3.05; 3 -0.65,-3.05; 4 0,-3.05; 5 0.65,-3.05; 6 1.3,-3.05; 7 1.95,-3.05; 8 1.95,3.05; 9 1.3,3.05; 10 0.65,3.05; 11 0,3.05; 12 -0.65,3.05; 13 -1.3,3.05; 14 -1.95,3.05
CPC10*N = smd 1.3 x 0.6: 1 -2.8,1.27; 2 -2.8,-1.27; 3 2.8,-1.27; 4 2.8,1.27
HC49/4HSMX = smd 5.5 x 2: 1 -4.75,0; 2 4.75,0

### Placement (x,y rotation side)
A1  35.7,6.7 180 top
C1  15.3,29.9 270 top
C2  24.6,29.9 270 top
C3  33.4,60.5 180 bottom
C4  41.5,42.4 180 bottom
C5  35.4,42.4 180 bottom
C6  33.1,39.8 270 bottom
C7  33.1,34.5 90 bottom
C8  33.2,30 90 bottom
C9  34.3,26.8 180 bottom
C10  40,26.6 180 bottom
C11  46.9,26.9 180 bottom
C12  48.9,32.5 90 bottom
C13  15,7.5 90 top
C14  16.4,36 90 top
C15  16.4,44.7 90 top
C16  24,9.5 270 bottom
C17  20,14.5 90 bottom
C18  24.3,48.4 180 top
C19  22.1,42 90 bottom
C20  27.2,43.7 90 top
C21  51,20.8 0 bottom
C22  59,19.5 0 bottom
C23  29.4,21.5 180 bottom
C24  33,13.5 180 bottom
C25  37.2,13.5 0 bottom
C26  45,7.5 90 top
C27  48.9,38.9 270 bottom
D1  26,13.5 180 bottom
D2  30,13.5 0 top
J1  0,32 270 top
J2  32,18.5 0 top
J3  32,55.3 0 top
J4  51.7,62.5 90 top
J5  42,64.6 180 top
J6  41,56.5 90 top
J7  28.7,48.2 0 top
J8  70,60.5 90 top
J9  74.1,45.9 180 top
J10  60,13 270 top
J11  70,13 270 top
J12  69.5,24 0 top
J13  47,17.7 0 top
J14  20,53.5 180 top
J15  14.6,59.7 180 top
J16  15,14.5 0 top
J17  51.1,7.1 270 top
K1  60.9,57.6 90 top
LS1  73,36.5 270 top
Q1  39.9,51.3 270 bottom
Q2  73,36.1 180 bottom
Q3  51,53 270 top
Q4  46.6,54.9 0 top
Q5  46.9,53 270 bottom
Q6  45.8,61.2 0 bottom
Q7  41.7,62.1 90 bottom
Q8  73.8,58.7 180 bottom
Q9  47.1,9 90 bottom
Q10  69.2,53.16 0 top
Q11  69,49.94 0 bottom
R1  33.4,58.3 180 bottom
R2  30.5,59.3 90 bottom
R3  20,21.5 0 top
R4  24,21.5 180 top
R5  23.8,38.4 180 top
R6  24.8,45.8 270 top
R7  44.4,14.2 270 bottom
R8  47,14.2 270 bottom
R9  49.6,14.2 270 bottom
R10  43.3,53.7 90 bottom
R11  78.5,54.7 270 top
R12  50.2,56.1 180 top
R13  50.2,56.1 180 bottom
R14  45.5,57.5 90 bottom
R15  38.9,58.5 270 bottom
R16  47.5,5.5 180 bottom
R17  69.1,49.78 0 top
R18  38.8,18.4 270 top
SJ1  70.2,65.6 180 top
SW1  29.6,65.7 270 top
TP1  56,20.6 0 top
TP2  60.5,21 90 top
TP3  60.5,25.5 90 top
TP4  24,18.4 0 top
TP5  28.6,6.8 270 top
TP6  27.2,40.6 90 top
TP7  22.1,46.3 180 top
TP8  37.9,49.9 0 top
TP9  53.9,56.1 0 top
TP10  44.8,49.9 0 top
TP11  45.9,59.3 90 top
TP12  41.4,49.9 0 top
TP14  37.9,68.8 0 top
TP15  56,24.1 0 top
U1  41,34.5 180 top
U2  23,9.5 180 top
U3  24,42.5 270 top
U4  57,23.5 90 bottom
U5  74,52.5 270 top
Y1  20,25.5 0 top

### Tracks (layer width: path | path; a pad name or v marks a point on that pad's centre or on a via)
3.3V  (via drill 0.3)
  Top 0.152: C4.1 40.8,42.4 41.2,42.8 U1.18 | U1.33 35.2,42.55 35.05,42.4 C5.1 33.31,42.4 31.56,44.16 31.56,50.16 30.73,50.99 J3.2 | C6.1 33.1,40.2 32.8,39.9 U1.41 | U1.55 32.98,34.3 33.1,34.18 C7.1 | C8.1 33.2,30.18 32.68,30.7 U1.64 | C10.1 39.75,26.6 40,26.35 U1.88 | C11.1 47.04,26.9 47.6,26.34 U1.107 | C12.1 48.9,32.53 49.07,32.7 U1.122 | U1.137 49.1,38.7 48.48,39.33 | U1.74 34.4,26.8 33.91,27.29
  Top 0.254: U2.3 20.71,17.95 22.44,19.68 25.76,19.68 30.18,24.1 30.73,24.1 v33.43,26.8 33.91,27.29 | 39.15,27.68 34.31,27.68 33.91,27.29 | C10.1 39.15,27.68 | 39.15,27.68 46.05,27.68 | 46.05,27.68 47.15,28.78 47.15,31.65 | 46.05,27.68 C11.1 | 47.15,31.65 C12.1 | 47.15,31.65 47.15,38 48.48,39.33 C27.1 | 34.16,40.65 C6.1 | 34.16,33.66 34.16,29.61 33.7,29.15 C8.1 33.2,28 33.91,27.29 | 34.16,33.66 34.16,40.65 | 34.16,40.65 38.9,40.65 C4.1 | C7.1 34.15,33.65 34.16,33.66
  Top 0.381: C13.+ 17.86,9.9 v20.47,12.51 20.47,13.21 U2.3 20.71,14.11 v21.02,14.42
  Bottom 0.152: U4.1 52.65,21.55 51.9,20.8 C21.1 51.83,20.8 49.83,22.8 48.96,22.8 46.05,25.71 C11.1 | R1.2 34.25,58.25 32.92,56.92 32.35,56.92 J3.2 | C9.1 v33.43,26.8
  Bottom 0.254: C5.1 34.47,42.32 34.47,42.22 33.2,40.95 33.2,40.61 33.18,40.63 33.12,40.63 C6.1
  Bottom 0.381: C17.1 19.68,13.23 J16.3 J16.1 | v21.02,14.42 20.15,13.55 C17.1 | U2.3 20.1,13.45 C17.1 | C17.1 20.47,13.08 v20.47,12.51
  other vias: 20.71,13.45 40.65,42.4 34.55,42.4 33.1,40.65 33.1,33.65 33.2,29.15 39.15,26.6 46.05,26.9 48.9,31.65 48.9,39.75
3V_REF
  Top 0.203: U1.40 27.5,40.3
  Top 0.305: TP6.1 27.5,40.3
  Top 0.508: R6.2 25.3,44.45 U3.6 U3.5 26.85,42.5 C20.1 27.08,42.73 27.08,40.72 TP6.1
5V
  Top 0.152: R11.2 78.5,42.18 76,39.68 | R5.2 C14.+
  Top 0.508: LS1.+ 75.38,40.3 76,39.68 76.66,39.02 76.66,26.06 73.3,22.7
  Top 1.27: J1.P9 J1.P8 | J1.P7 J1.P8 | 9.6,38.4 J1.P8
  Top 1.524: C14.+ 9.6,38.4 | J1.P8 6.12,38.98 | 6.12,38.98 6.12,46.72 1.14,51.7 1.14,59.72 2.39,60.97 J15.19 J15.17 J15.15 J15.13 J15.11 J15.9 J15.7 J15.5 J15.3 J15.1 | 6.12,38.98 6.12,14.42 8.58,11.96 8.58,5.26 11.98,1.86 55.72,1.86 60,6.14 J10.3 J11.3 71.74,10.5 74.48,13.24 74.48,21.52 73.3,22.7 J12.3
  Bottom 0.152: J6.2 41.22,56.5 43.17,54.55 R10.2 43.36,54.55 45.46,56.65 R14.1 | J10.3 58.48,12.02 58.48,18.16 59.82,19.5 C22.1 60.05,19.7 U4.14
  Bottom 0.254: J15.1 29.22,64.16 32.33,64.16 38.84,57.65 R15.2 39.85,57.65 J6.2
5V_SB  (via drill 0.3)
  Top 0.152: R12.1 v51.07,56.08 v51.07,56.07 49.92,54.92 44.7,54.92 44.5,54.72 v44.5,54.02 | U3.3 22.42,41.55 22.1,41.23 C19.1 23.82,39.43 23.82,37.18 22.6,35.96 15.78,35.96 11.48,31.66 11.48,20.82 14.92,17.38 v20.06,17.38 | U3.3 U3.4 | U3.3 22.33,41.55 20.14,43.74 20.14,47.08 23.04,49.98 25.32,49.98 27.76,52.42 27.76,55.28 29.46,56.98 37.22,56.98 39,55.2 v41.66,55.2
  Top 0.254: J13.1 41.22,18.4 37.96,18.4 37.2,17.64 37.2,17.16 35.88,15.84 30,15.84 27.93,13.77 27.93,13.45
  Top 0.381: U2.1 27.93,13.45 D2.C 28.6,12.88 TP5.1 | v25.3,14.3 25.3,13.46 U2.1 | v25.28,12.6 U2.1
  Bottom 0.152: v51.07,56.08 R12.1 | D1.C 23.5,13.97 23.5,15.02 21.14,17.38 v20.06,17.38 | J13.1 41.92,15.7 44.27,13.35 R7.2 R8.2 R9.2 | v41.66,55.2 42.14,54.72 42.14,54.02 42.46,53.7 44.18,53.7 v44.5,54.02
  Bottom 0.381: C16.1 23.98,10.47 D1.C 25.24,13.5 U2.1 | U2.1 25.29,14.29 v25.3,14.3 | U2.1 v25.29,12.61 v25.28,12.6
  other vias: 25.29,13.45 22.1,41.15
5V_USB  (via drill 0.3)
  Top 0.152: U1.73 34,23.66 31.84,21.5 C23.1 28.19,21.14 J2.1 28.09,18.4 TP4.1
  Bottom 0.381: J2.1 28.19,13.66 D1.A
  other vias: 28.55,21.5
5V_WD  (via drill 0.3)
  Top 0.152: R18.2 38.73,17.55 34.68,13.5 D2.A
  Top 0.381: A1.3 33.16,12.08 32.02,13.21 D2.A
  Bottom 0.381: D2.A C24.1
  other vias: 32.02,13.5
12V
  Top 0.152: K1.3 68.82,62.45 68.82,57.08 70.28,55.62 70.28,53.5 69.96,53.18 66.6,53.18 64.71,51.29 K1.1
  Top 1.27: J1.P13 J1.P14 J1.P15 | C15.+ 9.6,47.1 J1.P15 | J1.P15 9.6,52.74 11.63,54.77 J14.9 J14.7 J14.5 J14.3 J14.1 25.6,54.77 28.38,57.55 28.38,61.12 29.7,62.44 39.16,62.44 40.73,64.01 J5.2 40.73,67.15 42.24,68.66 62.61,68.66 K1.3
12V_PUMP
  Top 1.27: J4.2 53.89,63.77 56.74,60.92 62.73,60.92 K1.2
12V_PUMP_WD
  Top 1.27: Q10.3 69.2,54.42 67.82,55.8 67.82,60.28 64.08,64.02 K1.4
12V_WD  (via drill 0.3)
  Top 0.508: Q9.2 44.95,9.95
  Top 1.27: A1.1 v43.96,9.98 44.92,9.98 44.95,9.95 C26.+ | C26.+ 45,9.1 45.03,9.07 v44.99,9.03 | C26.+ v45,10.76 | C26.+ 47.4,9.9 48.78,11.28 51.78,11.28 58.52,18.02 62.58,18.02 64.94,20.38 64.94,42.36 69.95,47.37 R17.2 69.95,50.26 70.15,50.46 Q10.2
  Bottom 0.508: 45.02,9.92 C26.+ | 45.97,9.92 Q9.2 | v44.99,9.03 C26.+ | C26.+ | v45,10.76 C26.+ | v43.96,9.98 44.9,9.98 C26.+
  Bottom 1.27: 45.97,9.92 45.02,9.92 | C25.1 38.24,13.41 A1.1
  other vias: 45,9.9 46,9.95
12V_WD_PROTECT
  Bottom 0.152: R16.1 46.36,5.79 46.36,7.69 Q9.1
12V_WD_RAW
  Bottom 1.27: J17.1 48.83,8.37 Q9.3
!MCLR
  Top 0.152: J3.1 30.58,56.42 36.42,56.42 39.66,53.18 39.66,48.18 40.4,47.44 U1.20
  Bottom 0.152: R2.1 30.45,58.45 29.46,57.46 J3.1
!MCLR!_FILTER  (via drill 0.3)
  Top 0.152: R2.2 30.35,60 SW1.2
  Bottom 0.152: R2.2 30.69,60.34 32.39,60.34 C3.1 R1.1
  other vias: 30.5,60.15
ALED_A  (via drill 0.3)
  Bottom 0.152: J10.2 62.04,15.04 62.04,21.76 61.6,22.2 U4.13 57.6,22.2 TP1.1
  other vias: 56,20.6
ALED_A_RAW  (via drill 0.3)
  Top 0.152: U1.104 46.4,23.14 47.34,22.2 v52.4,22.2
  Bottom 0.152: v52.4,22.2 U4.2
ALED_B  (via drill 0.3)
  Top 0.152: TP2.1 59.16,21 58.68,21.48 v58.68,22.8
  Bottom 0.152: v58.68,22.8 58.73,22.85 U4.12 62.17,22.85 64.5,20.52 64.5,15.6 67.1,13 J11.2
ALED_B_RAW  (via drill 0.3)
  Top 0.152: U1.109 50.7,24.94 51.93,23.71 v51.93,22.85
  Bottom 0.152: v51.93,22.85 U4.3
ALED_C  (via drill 0.3)
  Top 0.152: TP3.1 59.18,25.5 58.68,25 v58.68,23.61
  Bottom 0.152: v58.68,23.61 59.94,23.61 U4.11 62.84,23.5 64.24,22.1 67.6,22.1 J12.2
ALED_C_RAW  (via drill 0.3)
  Top 0.152: U1.110 52.32,27.9 52.58,27.64 v52.58,23.5
  Bottom 0.152: v52.58,23.5 U4.4
ALED_OE  (via drill 0.3)
  Top 0.152: U1.103 46,22.98 48.4,20.58 53.02,20.58 54.38,19.22 57.54,19.22 58.16,19.84 58.16,22.76 56.82,24.1 TP15.1
  Bottom 0.152: TP15.1 57.35,25.45 U4.8
  other vias: 56,24.1
BUZZER_EN  (via drill 0.3)
  Top 0.152: U1.9 44.8,46.4 45.88,47.48 66.18,47.48 v66.66,47.96
  Bottom 0.152: v66.66,47.96 66.66,42.8 72.05,37.41 Q2.1
BUZZER_L
  Bottom 0.152: Q2.3 LS1.-
EMERGENCY_SD_C1
  Top 0.152: J9.1 75.37,49.6 U5.4
EMERGENCY_SD_C2
  Top 0.152: U5.3 72.83,49.6 J9.2
EMERGENCY_SD_DRIVE+
  Top 0.152: U5.1 75.52,55.55 R11.1
EMERGENCY_SD_DRIVE-  (via drill 0.3)
  Top 0.152: Q8.3 72.73,56.53 U5.2
  other vias: 73.8,57.6
EMERGENCY_SD_TRIGGER  (via drill 0.3)
  Top 0.152: U1.10 44.4,46.72 45.6,47.92 49.7,47.92 v58.2,56.42
  Bottom 0.152: v58.2,56.42 70.78,56.42 72.85,58.49 Q8.1
FAN_PWM  (via drill 0.3)
  Bottom 0.152: R14.2 45.8,58.65 Q6.3 J5.4 45.81,67.49 44.5,68.8 TP14.1
  other vias: 37.9,68.8
FAN_PWM_DRIVE  (via drill 0.3)
  Top 0.152: U1.15 42.4,47.94 43.08,48.62 43.08,60.52 43.84,61.28 v46.88,61.28
  Bottom 0.152: v46.88,61.28 46.88,60.23 Q6.1
FAN_TACH  (via drill 0.3)
  Top 0.152: TP12.1 42,49.9 | 42,49.9 U1.16 | 42,49.9 42.24,50.14 42.24,61.54 Q7.3
  other vias: 42.8,62.1
FAN_TACH_RAW
  Bottom 0.152: R15.1 38.9,60.8 39.25,61.15 Q7.1 40.81,61.15 41.68,62.02 41.68,63.01 J5.3
FLOW_TACH  (via drill 0.3)
  Top 0.152: U1.23 39.2,49.12 38.42,49.9 TP8.1
  Bottom 0.152: TP8.1 37.9,50.62 38.58,51.3 Q1.3
  other vias: 37.9,49.9
FLOW_TACH_RAW
  Bottom 0.152: J6.3 Q1.1 41.29,52.54 42.99,52.54 R10.1
FPLED_!B
  Top 0.152: U1.98 44,22.34 45.9,20.44 47.56,20.44 49.54,18.46 J13.4
  Bottom 0.152: J13.4 49.54,15.11 R9.1
FPLED_!G
  Top 0.152: U1.97 43.6,21.86 47,18.45 J13.3
  Bottom 0.152: J13.3 R8.1
FPLED_!R
  Top 0.152: U1.96 43.2,21.42 44.46,20.16 J13.2
  Bottom 0.152: J13.2 44.46,15.11 R7.1
GND  (via drill 0.3)
  Top 0.152: C4.2 41.8,42.4 41.6,42.6 U1.17 | C5.2 35.72,42.4 35.6,42.52 U1.32 | U1.42 32.74,39.5 33.1,39.14 C6.2 | U1.54 32.98,34.7 33.1,34.82 C7.2 | U1.63 33.15,31.1 v33.2,31.05 | C9.2 34.92,26.8 34.8,26.68 U1.75 | U1.89 40.4,26.2 40.8,26.6 C10.2 | v47.85,27 47.85,26.8 48,26.65 U1.108 | U1.123 49.22,33.1 48.97,33.35 C12.2 | U1.136 49.15,38.3 C27.2 | U3.2 22.34,42.5 22.1,42.74 C19.2 22.1,43.15 22.4,43.45 U3.1
  Top 0.61: v12.76,36.44 v11.96,36.44 v11.14,36.44 v11.13,36.45 J1.P6 v8.11,36.45 v8.1,36.44 | v12.76,35.18 v11.96,35.18 v11.14,35.18 v11.13,35.17 J1.P5 v8.11,35.17 v8.1,35.18 | v12.76,33.9 v11.96,33.9 v11.14,33.9 v11.13,33.91 J1.P4 v8.11,33.91 v8.1,33.9 | v12.74,41.52 v11.94,41.52 v11.14,41.52 v11.13,41.52 J1.P10 v8.11,41.52 v8.1,41.52 | v12.74,44.06 v11.94,44.06 v11.14,44.06 v11.13,44.06 J1.P12 v8.11,44.06 v8.1,44.06
  other vias: 42.35,42.4 36.25,42.4 33.1,38.95 33.1,35.35 35.15,26.8 40.85,26.6 48.9,33.35 48.9,38.05 22.1,42.85 47.4,50.7 37.2,48 35,48 35,50 36,52 39,42 46.5,41.5 45.9,29.4 35.6,28.5 35.7,39.7 27,35 24,34 21,31 18,30 13,30 10,27 9,27 14,49 12,49 12,51 8,2 62,3 68,5 78,18 79,27 80,46 78,36 68,29 67,40 69,43 65,46 58,45 61,49 60,55 59.98,57.08 60,59 59,59 59,55 61,59 61,55 18.2,12.3 21.6,15.9 22,17.7 27.1,16.6 29.3,16.6 39.5,13 47.4,6.9 45.8,7.1 57.5,10.8 57.5,13.6 56.6,18.4 61.7,12.4 63.3,14.8 63.3,16.6 61.8,8.7 64.6,8.7 65.5,12.5 63.1,20.6 63.5,24.1 66.6,21.3 56.3,23 43.1,15.9 45.7,15.9 48.3,15.9 41.6,14.5 69,38 71.6,39.5 35.8,59.4 36.9,60.8 30.2,63.6 31.2,64.9 28.6,64.7 26.8,63 31.8,59.4 39.9,55.8 38.2,60.8 45,66.5 46.6,66.5 66.64,57.02 66.56,59.18 66.68,55.74 71.6,58.5 72.6,57.3 49.3,60.2 50.3,58.7 14.1,20.4 17.2,19.6 29.3,24.6 27.4,28.4 60,66 66.4,63.7 67,66 30.9,23.1 51.5,25.4 39.6,54.5 33.9,53.9 39.76,46.86 53.7,53.4 50,50.1 21.4,44.1 22.2,47.6 14.6,32.2 13.7,32.2 19,33.3 14,33.2 17.1,3.5 12.4,4.8 17.7,4.8 27.2,4.5 18.9,7.8 27,7.3 42.3,4.8 43.2,3.5 28.5,44.3 27.6,45.8 26,45 28.9,39.42 41.2,47.4 53.7,39.2 53.7,32.7 50.7,23.2 40.2,21.8 32.9,21.8 47.4,49.8
  pour Top (rank 6): -1,70 0,71 81,71 82,70 82,0 81,-1 0,-1 -1,0
  pour Bottom (rank 6): -1,70 0,71 81,71 82,70 82,0 81,-1 0,-1 -1,0
LOGO
  pour Top: 54.5,42.1 55.4,43 56,43 61.7,43 62.3,42.4 62.5,42.2 62.5,41.2 62.5,31.3 62.1,30.9 61.7,30.5 61.2,30.5 55.3,30.5 54.9,30.9 54.5,31.3 54.5,31.9
OSC1
  Top 0.152: R3.2 20.85,23.35 23,25.5 24.66,25.5 | 24.66,25.5 Y1.2 26.45,25.5 28.85,27.9 U1.71 | C2.2 24.6,25.56 24.66,25.5
OSC2
  Top 0.152: R4.1 26.16,21.5 28.38,23.72 28.38,26.18 29.7,27.5 U1.72
OSC2_R
  Top 0.152: 15.32,25.5 17,25.5 19.15,23.35 R3.1 19.15,21.43 20.18,20.4 22.1,20.4 23.15,21.45 R4.2 | 15.32,25.5 Y1.1 | C1.2 15.3,25.52 15.32,25.5
PGEC
  Top 0.152: J3.5 34.54,52.48 34.4,52.34 U1.35
PGED
  Top 0.152: J3.4 33.27,53.02 34,52.29 U1.36
POWER_SENSE
  Top 0.152: R5.1 24.65,38.38 25.13,37.9 U1.46
PUMP_PWM
  Top 0.152: J4.4 51.7,58.56 49.35,56.21 R12.2 49.25,56 Q4.3 46.28,56.32 46.28,58.92 TP11.1
PUMP_PWM_DRIVE
  Top 0.152: U1.12 43.6,47.14 45.2,48.74 46.26,48.74 46.7,49.18 46.7,52.56 45.65,53.61 Q4.1
PUMP_TACH  (via drill 0.3)
  Top 0.152: U1.14 42.8,47.38 43.8,48.38 43.8,49.5 44.2,49.9 TP10.1 45.3,49.9 45.8,50.4 v45.8,52
  Bottom 0.152: v45.8,52 Q5.3
PUMP_TACH_RAW
  Bottom 0.152: Q5.1 48.21,53.95 49.35,55.09 R13.1 49.35,58.88 J4.3
PUMP_WD_DRIVE  (via drill 0.3)
  Top 0.152: R17.1 Q10.1
  Bottom 0.152: Q10.1 69,51.31 Q11.3
  other vias: 68.25,52.06
PUMP_WD_RUN  (via drill 0.3)
  Top 0.152: U1.8 45.2,46.12 46.18,47.1 v67.76,47.1
  Bottom 0.152: v67.76,47.1 68.42,47.1 69.95,48.63 Q11.1
TACH_OUT  (via drill 0.3)
  Top 0.152: Q3.3 52.1,55.1 53.1,56.1 TP9.1 56.92,56.1 v58.46,57.64
  Bottom 0.152: J8.3 69.68,57.64 v58.46,57.64
TACH_OUT_DRIVE
  Top 0.152: U1.11 44,46.92 45.42,48.34 46.94,48.34 48.52,49.92 48.52,52.78 49.69,53.95 Q3.1
TACH_OUT_GNDLINK
  Top 0.152: SJ1.1 70.96,64 J8.1
TEMP_SENSE
  Top 0.152: TP7.1 22.26,46.46 24.61,46.46 R6.1 25.15,47 C18.1 27.23,48.4 J7.1 27.43,47.43 29.56,45.3 29.62,45.3 33.9,41.02 37.38,41.02 38.4,42.04 U1.25
USB_D+
  Top 0.152: U1.77 35.6,23.2 33.27,20.88 J2.3
USB_D-
  Top 0.152: J2.2 30.73,19.31 31.78,20.36 32.36,20.36 35.2,23.2 U1.76
WD_DETECT
  Top 0.152: R18.1 38.75,19.25 37.2,20.8 U1.81

### Text on the board
tPlace: - + | - + | + | ©2022 BlockWorker / blockworker.de | JLCJLCJLCJLC | + | + | + - | - +